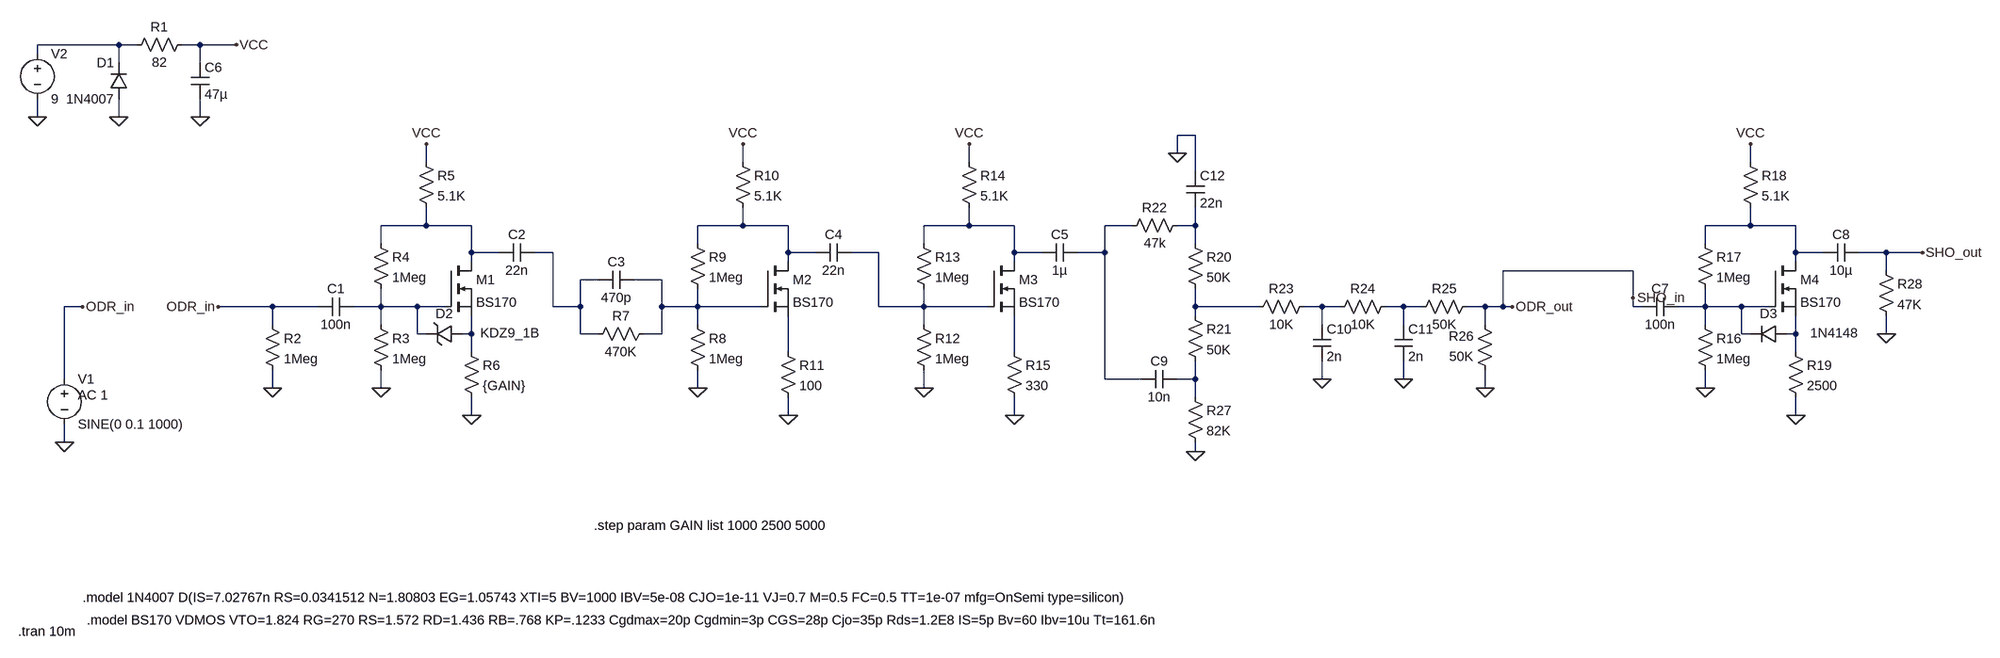
[diagram p0: schematic rob_sim.asc]
rob_sim.asc, the LTspice schematic file:
Version 4
SHEET 1 3124 680
WIRE -256 -816 -400 -816
WIRE -224 -816 -256 -816
WIRE -112 -816 -144 -816
WIRE -48 -816 -112 -816
WIRE -400 -800 -400 -816
WIRE -256 -784 -256 -816
WIRE -112 -784 -112 -816
WIRE -400 -688 -400 -720
WIRE -256 -688 -256 -720
WIRE -112 -688 -112 -720
WIRE 1648 -656 1616 -656
WIRE 1616 -624 1616 -656
WIRE 288 -608 288 -640
WIRE 848 -608 848 -640
WIRE 1248 -608 1248 -640
WIRE 2688 -608 2688 -640
WIRE 1648 -592 1648 -656
WIRE 288 -496 288 -528
WIRE 288 -496 208 -496
WIRE 368 -496 288 -496
WIRE 848 -496 848 -528
WIRE 848 -496 768 -496
WIRE 928 -496 848 -496
WIRE 1248 -496 1248 -528
WIRE 1248 -496 1168 -496
WIRE 1328 -496 1248 -496
WIRE 1536 -496 1488 -496
WIRE 1648 -496 1648 -528
WIRE 1648 -496 1616 -496
WIRE 2688 -496 2688 -528
WIRE 2688 -496 2608 -496
WIRE 2768 -496 2688 -496
WIRE 208 -464 208 -496
WIRE 768 -464 768 -496
WIRE 1168 -464 1168 -496
WIRE 1648 -464 1648 -496
WIRE 2608 -464 2608 -496
WIRE 368 -448 368 -496
WIRE 416 -448 368 -448
WIRE 512 -448 480 -448
WIRE 928 -448 928 -496
WIRE 976 -448 928 -448
WIRE 1088 -448 1040 -448
WIRE 1328 -448 1328 -496
WIRE 1376 -448 1328 -448
WIRE 1488 -448 1488 -496
WIRE 1488 -448 1440 -448
WIRE 2768 -448 2768 -496
WIRE 2816 -448 2768 -448
WIRE 2928 -448 2880 -448
WIRE 2992 -448 2928 -448
WIRE 368 -432 368 -448
WIRE 928 -432 928 -448
WIRE 1328 -432 1328 -448
WIRE 2768 -432 2768 -448
WIRE 2480 -416 2192 -416
WIRE 2928 -416 2928 -448
WIRE 592 -400 560 -400
WIRE 704 -400 656 -400
WIRE 2480 -368 2480 -416
WIRE -320 -352 -352 -352
WIRE 16 -352 -80 -352
WIRE 96 -352 16 -352
WIRE 208 -352 208 -384
WIRE 208 -352 160 -352
WIRE 272 -352 208 -352
WIRE 320 -352 272 -352
WIRE 512 -352 512 -448
WIRE 560 -352 560 -400
WIRE 560 -352 512 -352
WIRE 704 -352 704 -400
WIRE 768 -352 768 -384
WIRE 768 -352 704 -352
WIRE 880 -352 768 -352
WIRE 1088 -352 1088 -448
WIRE 1168 -352 1168 -384
WIRE 1168 -352 1088 -352
WIRE 1280 -352 1168 -352
WIRE 1648 -352 1648 -384
WIRE 1760 -352 1648 -352
WIRE 1872 -352 1840 -352
WIRE 1904 -352 1872 -352
WIRE 2016 -352 1984 -352
WIRE 2048 -352 2016 -352
WIRE 2160 -352 2128 -352
WIRE 2192 -352 2192 -416
WIRE 2192 -352 2160 -352
WIRE 2208 -352 2192 -352
WIRE 2480 -352 2480 -368
WIRE 2496 -352 2480 -352
WIRE 2608 -352 2608 -384
WIRE 2608 -352 2560 -352
WIRE 2672 -352 2608 -352
WIRE 2720 -352 2672 -352
WIRE 1648 -336 1648 -352
WIRE 16 -320 16 -352
WIRE 208 -320 208 -352
WIRE 768 -320 768 -352
WIRE 1168 -320 1168 -352
WIRE 1872 -320 1872 -352
WIRE 2016 -320 2016 -352
WIRE 2160 -320 2160 -352
WIRE 2608 -320 2608 -352
WIRE 272 -304 272 -352
WIRE 288 -304 272 -304
WIRE 368 -304 368 -336
WIRE 368 -304 352 -304
WIRE 560 -304 560 -352
WIRE 592 -304 560 -304
WIRE 704 -304 704 -352
WIRE 704 -304 672 -304
WIRE 2672 -304 2672 -352
WIRE 2688 -304 2672 -304
WIRE 2768 -304 2768 -336
WIRE 2768 -304 2752 -304
WIRE 2928 -304 2928 -336
WIRE 368 -272 368 -304
WIRE 928 -272 928 -336
WIRE 1328 -272 1328 -336
WIRE 2768 -272 2768 -304
WIRE -352 -224 -352 -352
WIRE 1488 -224 1488 -448
WIRE 1552 -224 1488 -224
WIRE 1648 -224 1648 -256
WIRE 1648 -224 1616 -224
WIRE 1872 -224 1872 -256
WIRE 2016 -224 2016 -256
WIRE 16 -208 16 -240
WIRE 208 -208 208 -240
WIRE 768 -208 768 -240
WIRE 1168 -208 1168 -240
WIRE 2160 -208 2160 -240
WIRE 2608 -208 2608 -240
WIRE 1648 -192 1648 -224
WIRE 368 -160 368 -192
WIRE 928 -160 928 -192
WIRE 1328 -160 1328 -192
WIRE 2768 -160 2768 -192
WIRE -352 -112 -352 -144
WIRE 1648 -96 1648 -112
FLAG -80 -352 ODR_in
FLAG 16 -208 0
FLAG 208 -208 0
FLAG 368 -160 0
FLAG 288 -640 VCC
FLAG -352 -112 0
FLAG -320 -352 ODR_in
FLAG 768 -208 0
FLAG 928 -160 0
FLAG 848 -640 VCC
FLAG 1168 -208 0
FLAG 1328 -160 0
FLAG 1248 -640 VCC
FLAG -400 -688 0
FLAG -256 -688 0
FLAG -112 -688 0
FLAG -48 -816 VCC
FLAG 2608 -208 0
FLAG 2768 -160 0
FLAG 2688 -640 VCC
FLAG 2160 -208 0
FLAG 2016 -224 0
FLAG 1872 -224 0
FLAG 2208 -352 ODR_out
FLAG 1648 -96 0
FLAG 1616 -624 0
FLAG 2480 -368 SHO_in
FLAG 2928 -304 0
FLAG 2992 -448 SHO_out
SYMBOL res -128 -832 R90
WINDOW 0 0 56 VBottom 2
WINDOW 3 32 56 VTop 2
SYMATTR InstName R1
SYMATTR Value 82
SYMBOL diode -240 -720 R180
WINDOW 0 24 64 Left 2
WINDOW 3 24 0 Left 2
SYMATTR InstName D1
SYMATTR Value 1N4007
SYMBOL res 0 -336 R0
SYMATTR InstName R2
SYMATTR Value 1Meg
SYMBOL res 192 -336 R0
SYMATTR InstName R3
SYMATTR Value 1Meg
SYMBOL res 192 -480 R0
SYMATTR InstName R4
SYMATTR Value 1Meg
SYMBOL res 272 -624 R0
SYMATTR InstName R5
SYMATTR Value 5.1K
SYMBOL cap 160 -368 R90
WINDOW 0 0 32 VBottom 2
WINDOW 3 32 32 VTop 2
SYMATTR InstName C1
SYMATTR Value 100n
SYMBOL nmos 320 -432 R0
SYMATTR InstName M1
SYMATTR Value BS170
SYMBOL zener 352 -320 R90
WINDOW 0 -4 32 VBottom 2
WINDOW 3 -1 -84 VTop 2
SYMATTR InstName D2
SYMATTR Value KDZ9_1B
SYMBOL res 352 -288 R0
SYMATTR InstName R6
SYMATTR Value {GAIN}
SYMBOL cap 480 -464 R90
WINDOW 0 0 32 VBottom 2
WINDOW 3 32 32 VTop 2
SYMATTR InstName C2
SYMATTR Value 22n
SYMBOL voltage -352 -240 R0
WINDOW 123 24 44 Left 2
WINDOW 39 0 0 Left 2
SYMATTR InstName V1
SYMATTR Value SINE(0 0.1 1000)
SYMATTR Value2 AC 1
SYMBOL cap 656 -416 R90
WINDOW 0 0 32 VBottom 2
WINDOW 3 32 32 VTop 2
SYMATTR InstName C3
SYMATTR Value 470p
SYMBOL res 688 -320 R90
WINDOW 0 0 56 VBottom 2
WINDOW 3 32 56 VTop 2
SYMATTR InstName R7
SYMATTR Value 470K
SYMBOL res 752 -336 R0
SYMATTR InstName R8
SYMATTR Value 1Meg
SYMBOL res 752 -480 R0
SYMATTR InstName R9
SYMATTR Value 1Meg
SYMBOL res 832 -624 R0
SYMATTR InstName R10
SYMATTR Value 5.1K
SYMBOL nmos 880 -432 R0
SYMATTR InstName M2
SYMATTR Value BS170
SYMBOL res 912 -288 R0
SYMATTR InstName R11
SYMATTR Value 100
SYMBOL cap 1040 -464 R90
WINDOW 0 0 32 VBottom 2
WINDOW 3 32 32 VTop 2
SYMATTR InstName C4
SYMATTR Value 22n
SYMBOL res 1152 -336 R0
SYMATTR InstName R12
SYMATTR Value 1Meg
SYMBOL res 1152 -480 R0
SYMATTR InstName R13
SYMATTR Value 1Meg
SYMBOL res 1232 -624 R0
SYMATTR InstName R14
SYMATTR Value 5.1K
SYMBOL nmos 1280 -432 R0
SYMATTR InstName M3
SYMATTR Value BS170
SYMBOL res 1312 -288 R0
SYMATTR InstName R15
SYMATTR Value 330
SYMBOL cap 1440 -464 R90
WINDOW 0 0 32 VBottom 2
WINDOW 3 32 32 VTop 2
SYMATTR InstName C5
SYMATTR Value 1µ
SYMBOL cap -128 -784 R0
SYMATTR InstName C6
SYMATTR Value 47µ
SYMBOL voltage -400 -816 R0
WINDOW 123 0 0 Left 2
WINDOW 39 0 0 Left 2
SYMATTR InstName V2
SYMATTR Value 9
SYMBOL res 2592 -336 R0
SYMATTR InstName R16
SYMATTR Value 1Meg
SYMBOL res 2592 -480 R0
SYMATTR InstName R17
SYMATTR Value 1Meg
SYMBOL res 2672 -624 R0
SYMATTR InstName R18
SYMATTR Value 5.1K
SYMBOL cap 2560 -368 R90
WINDOW 0 0 32 VBottom 2
WINDOW 3 32 32 VTop 2
SYMATTR InstName C7
SYMATTR Value 100n
SYMBOL nmos 2720 -432 R0
SYMATTR InstName M4
SYMATTR Value BS170
SYMBOL diode 2752 -320 R90
WINDOW 0 -4 32 VBottom 2
WINDOW 3 -1 -84 VTop 2
SYMATTR InstName D3
SYMATTR Value 1N4148
SYMATTR Description Zener Diode
SYMATTR Type zener
SYMBOL res 2752 -288 R0
SYMATTR InstName R19
SYMATTR Value 2500
SYMBOL cap 2880 -464 R90
WINDOW 0 0 32 VBottom 2
WINDOW 3 32 32 VTop 2
SYMATTR InstName C8
SYMATTR Value 10µ
SYMBOL res 1632 -480 R0
SYMATTR InstName R20
SYMATTR Value 50K
SYMBOL res 1632 -352 R0
SYMATTR InstName R21
SYMATTR Value 50K
SYMBOL cap 1616 -240 R90
WINDOW 0 0 32 VBottom 2
WINDOW 3 32 32 VTop 2
SYMATTR InstName C9
SYMATTR Value 10n
SYMBOL res 1632 -512 R90
WINDOW 0 0 56 VBottom 2
WINDOW 3 32 56 VTop 2
SYMATTR InstName R22
SYMATTR Value 47k
SYMBOL res 1856 -368 R90
WINDOW 0 0 56 VBottom 2
WINDOW 3 32 56 VTop 2
SYMATTR InstName R23
SYMATTR Value 10K
SYMBOL cap 1856 -320 R0
SYMATTR InstName C10
SYMATTR Value 2n
SYMBOL res 2000 -368 R90
WINDOW 0 0 56 VBottom 2
WINDOW 3 32 56 VTop 2
SYMATTR InstName R24
SYMATTR Value 10K
SYMBOL cap 2000 -320 R0
SYMATTR InstName C11
SYMATTR Value 2n
SYMBOL res 2144 -368 R90
WINDOW 0 0 56 VBottom 2
WINDOW 3 32 56 VTop 2
SYMATTR InstName R25
SYMATTR Value 50K
SYMBOL res 2176 -224 R180
WINDOW 0 36 76 Left 2
WINDOW 3 36 40 Left 2
SYMATTR InstName R26
SYMATTR Value 50K
SYMBOL res 1632 -208 R0
SYMATTR InstName R27
SYMATTR Value 82K
SYMBOL cap 1632 -592 R0
SYMATTR InstName C12
SYMATTR Value 22n
SYMBOL res 2912 -432 R0
SYMATTR InstName R28
SYMATTR Value 47K
TEXT -320 504 Left 2 !.model 1N4007 D(IS=7.02767n RS=0.0341512 N=1.80803 EG=1.05743 XTI=5 BV=1000 IBV=5e-08 CJO=1e-11 VJ=0.7 M=0.5 FC=0.5 TT=1e-07 mfg=OnSemi type=silicon)
TEXT -312 544 Left 2 !.model BS170 VDMOS VTO=1.824 RG=270 RS=1.572 RD=1.436 RB=.768 KP=.1233 Cgdmax=20p Cgdmin=3p CGS=28p Cjo=35p Rds=1.2E8 IS=5p Bv=60 Ibv=10u Tt=161.6n
TEXT -434 564 Left 2 !.tran 10m
TEXT 584 120 Left 2 !.step param GAIN list 1000 2500 5000

The netlist it stands for:
* rob_sim.asc
R1 VCC N001 82
D1 0 N001 1N4007
R2 ODR_in 0 1Meg
R3 N011 0 1Meg
R4 N002 N011 1Meg
R5 VCC N002 5.1K
C1 N011 ODR_in 100n
M1 N002 N011 N016 N016 BS170
D2 N016 N011 KDZ9_1B
R6 N016 0 {GAIN}
C2 N008 N002 22n
V1 ODR_in 0 SINE(0 0.1 1000) AC 1
C3 N010 N008 470p
R7 N010 N008 470K
R8 N010 0 1Meg
R9 N003 N010 1Meg
R10 VCC N003 5.1K
M2 N003 N010 N018 N018 BS170
R11 N018 0 100
C4 N009 N003 22n
R12 N009 0 1Meg
R13 N004 N009 1Meg
R14 VCC N004 5.1K
M3 N004 N009 N019 N019 BS170
R15 N019 0 330
C5 N005 N004 1µ
C6 VCC 0 47µ
V2 N001 0 9
R16 N015 0 1Meg
R17 N007 N015 1Meg
R18 VCC N007 5.1K
C7 N015 SHO_in 100n
M4 N007 N015 N017 N017 BS170
D3 N017 N015 1N4148
R19 N017 0 2500
C8 SHO_out N007 10µ
R20 N006 N012 50K
R21 N012 N020 50K
C9 N020 N005 10n
R22 N006 N005 47k
R23 N013 N012 10K
C10 N013 0 2n
R24 N014 N013 10K
C11 N014 0 2n
R25 SHO_in N014 50K
R26 0 SHO_in 50K
R27 N020 0 82K
C12 0 N006 22n
R28 SHO_out 0 47K
.model D D
.lib standard.dio
.model NMOS NMOS
.model PMOS PMOS
.lib standard.mos
.model 1N4007 D(IS=7.02767n RS=0.0341512 N=1.80803 EG=1.05743 XTI=5 BV=1000 IBV=5e-08 CJO=1e-11 VJ=0.7 M=0.5 FC=0.5 TT=1e-07 mfg=OnSemi type=silicon)
.model BS170 VDMOS VTO=1.824 RG=270 RS=1.572 RD=1.436 RB=.768 KP=.1233 Cgdmax=20p Cgdmin=3p CGS=28p Cjo=35p Rds=1.2E8 IS=5p Bv=60 Ibv=10u Tt=161.6n
.tran 10m
.step param GAIN list 1000 2500 5000
.backanno
.end